# EAGLE schematic OCTOBOARDV_1.1 (EAGLE 9.5.1)
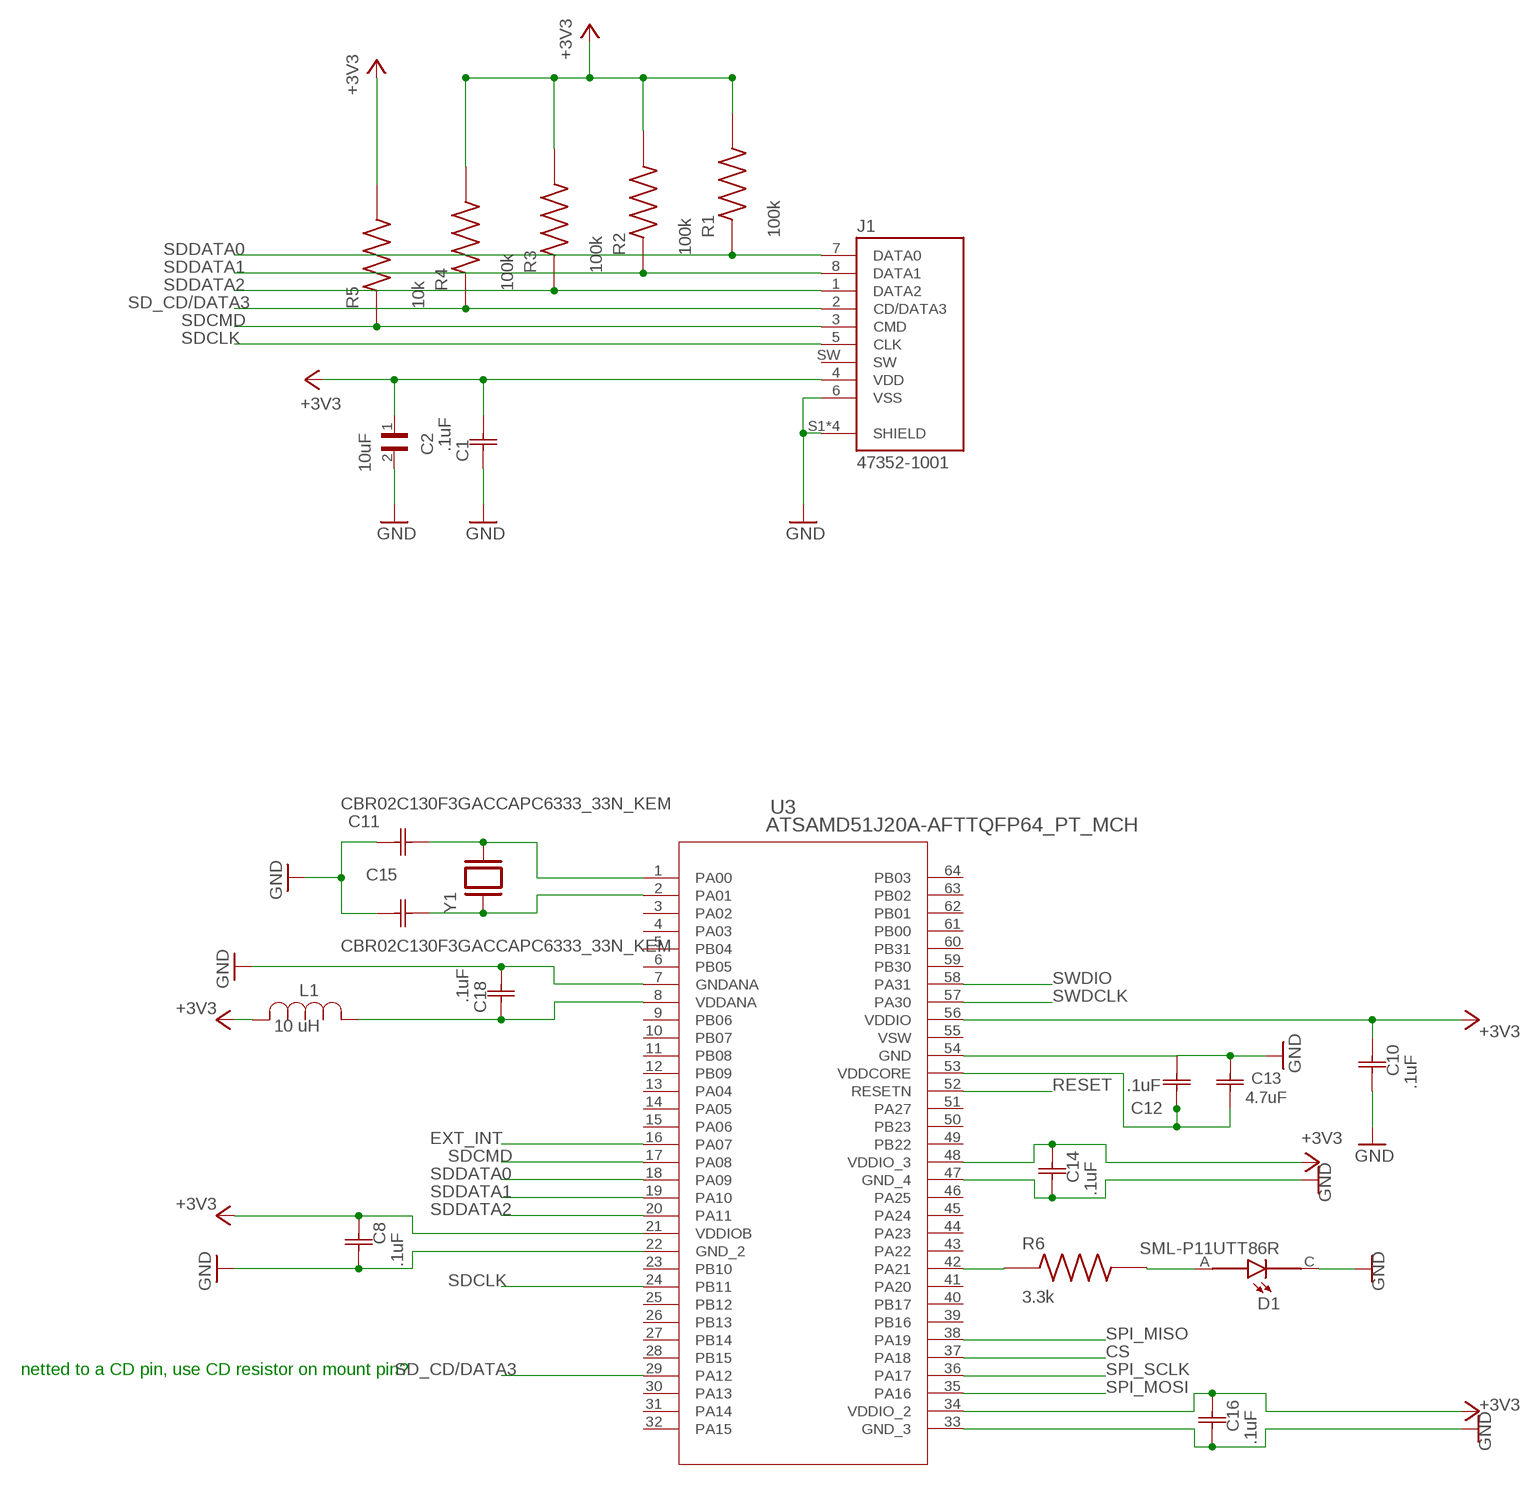
[diagram p0: schematic, sheet 1, part 1 of 2]
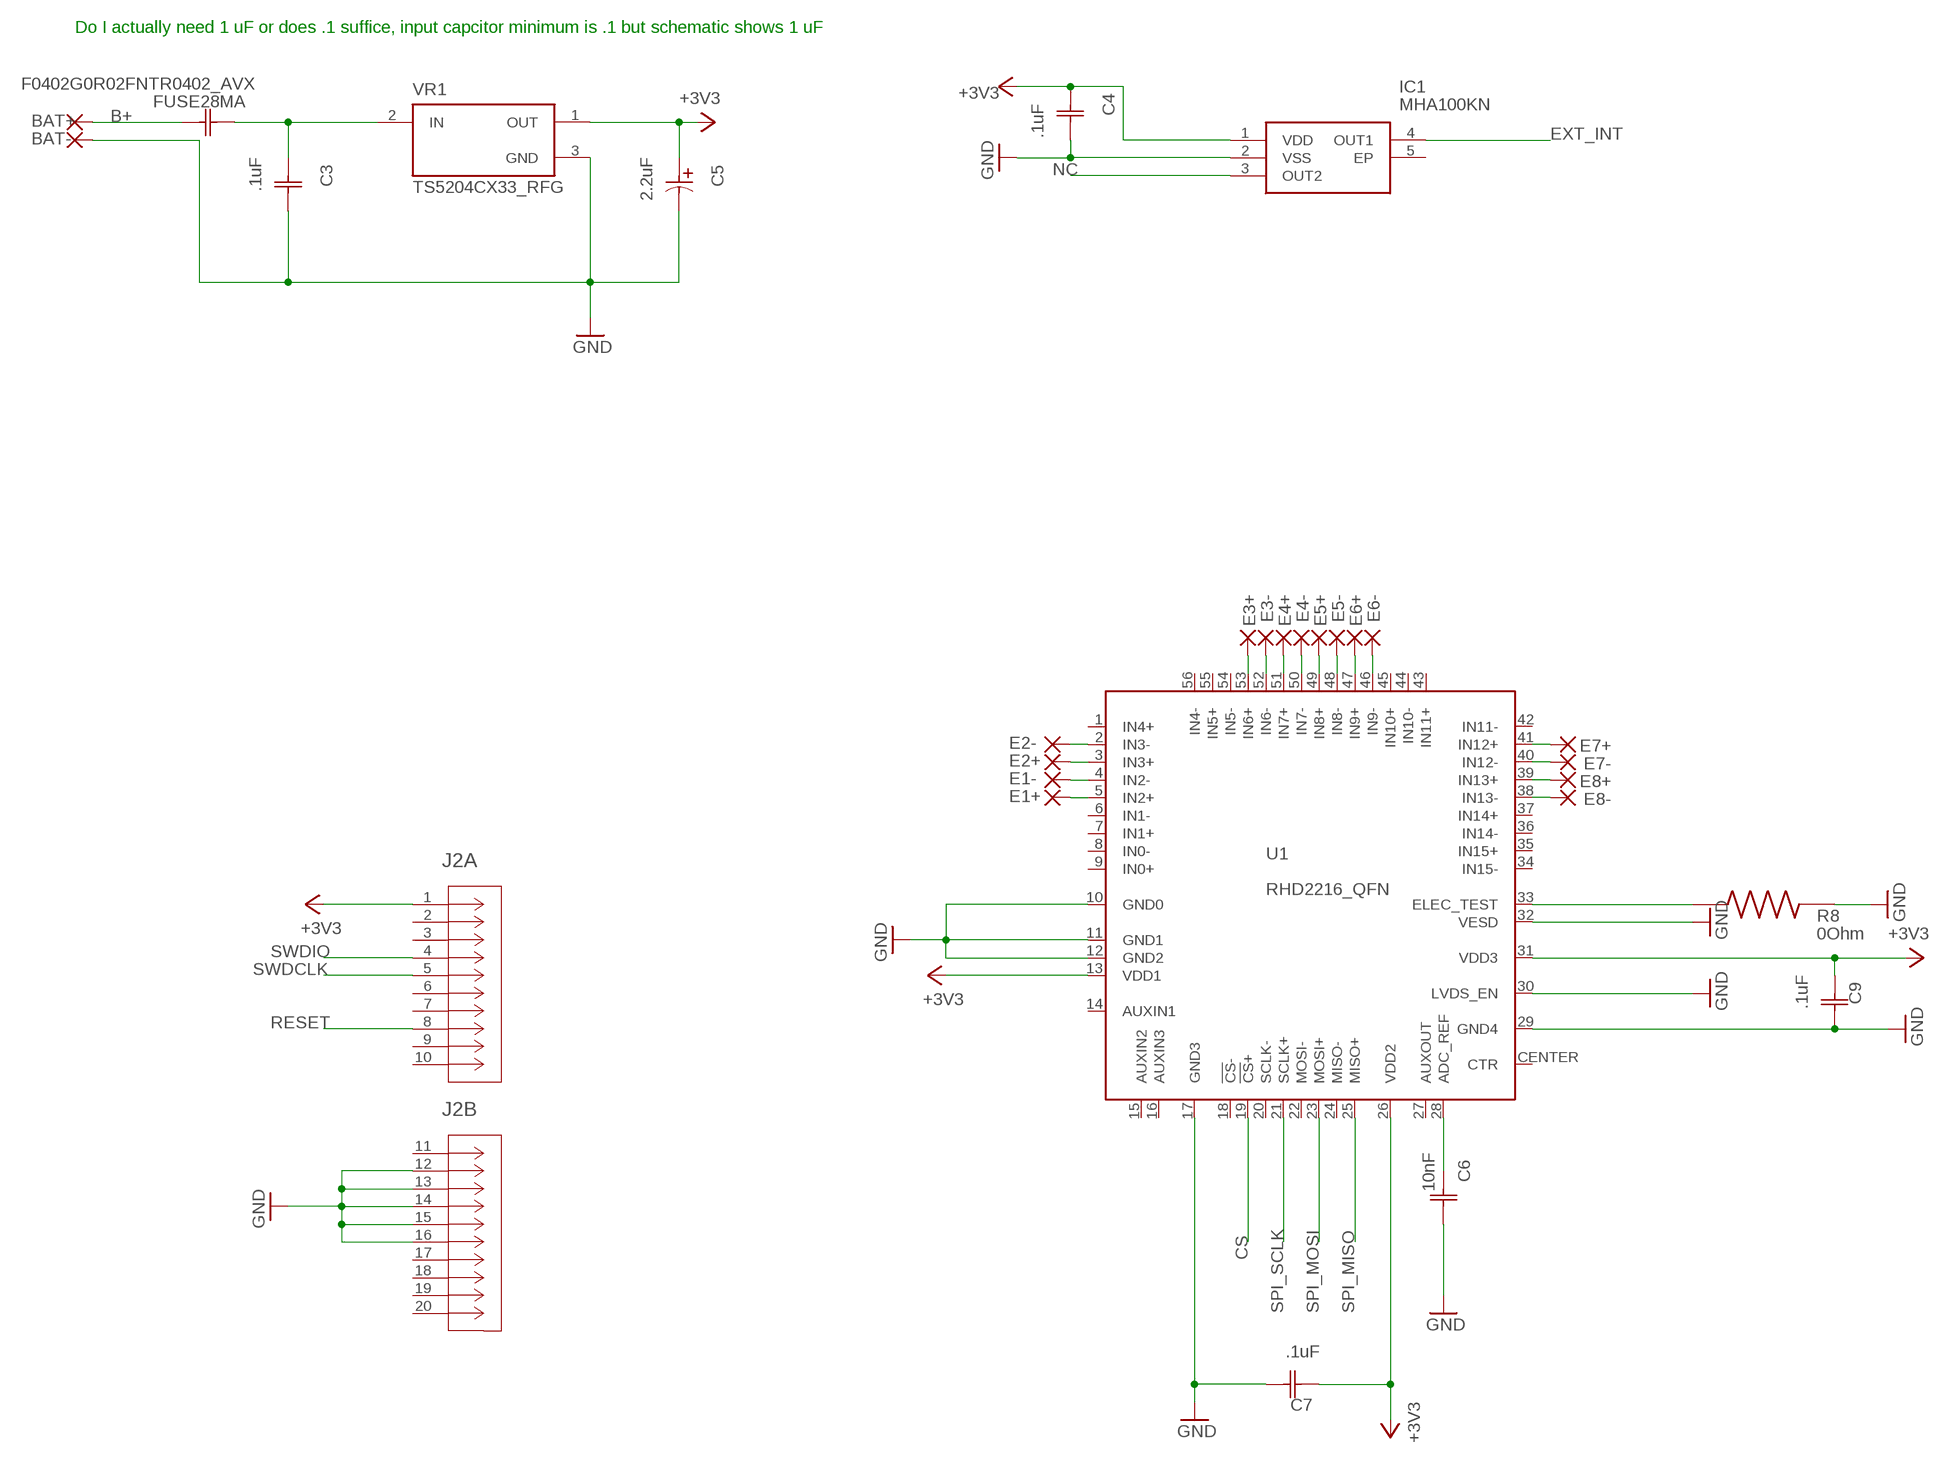
[diagram p1: schematic, sheet 1, part 2 of 2]

## Parts
BAT+  1.36/.71LEAD  [1,6/0,9]
BAT-  1.36/.71LEAD  [1,6/0,9]
C1  .1uF  0402B104K250CTCAP_0402_WAL  [CAP_0402_WAL]
C2  10uF  GRM155R61A106ME11D  [CAPC1005X70N]
C3  .1uF  0402B104K250CTCAP_0402_WAL  [CAP_0402_WAL]
C4  .1uF  0402B104K250CTCAP_0402_WAL  [CAP_0402_WAL]
C5  2.2uF  T491A225K016ATAUTOCAPMP3.4X1.6_1.8N_KEM  [CAPMP3.4X1.6_1.8N_KEM]
C6  10nF  CM02X5R103M16AHCAP_00J25AH_AVX  [CAP_00J25AH_AVX]
C7  .1uF  0402B104K250CTCAP_0402_WAL  [CAP_0402_WAL]
C8  .1uF  0402B104K250CTCAP_0402_WAL  [CAP_0402_WAL]
C9  .1uF  0402B104K250CTCAP_0402_WAL  [CAP_0402_WAL]
C10  .1uF  0402B104K250CTCAP_0402_WAL  [CAP_0402_WAL]
C11  CBR02C130F3GACCAPC6333_33N_KEM  [CAPC6333_33N_KEM]
C12  .1uF  0402B104K250CTCAP_0402_WAL  [CAP_0402_WAL]
C13  4.7uF  CM03X5R475M06AH055CAP_CM03_F_KAV  [CAP_CM03_F_KAV]
C14  .1uF  0402B104K250CTCAP_0402_WAL  [CAP_0402_WAL]
C15  CBR02C130F3GACCAPC6333_33N_KEM  [CAPC6333_33N_KEM]
C16  .1uF  0402B104K250CTCAP_0402_WAL  [CAP_0402_WAL]
C18  .1uF  0402B104K250CTCAP_0402_WAL  [CAP_0402_WAL]
D1  SML-P11UTT86R  [LED_SML-P11UTT86R]
E1+  1.36/.71LEAD  [1,6/0,9]
E1-  1.36/.71LEAD  [1,6/0,9]
E2+  1.36/.71LEAD  [1,6/0,9]
E2-  1.36/.71LEAD  [1,6/0,9]
E3+  1.36/.71LEAD  [1,6/0,9]
E3-  1.36/.71LEAD  [1,6/0,9]
E4+  1.36/.71LEAD  [1,6/0,9]
E4-  1.36/.71LEAD  [1,6/0,9]
E5+  1.36/.71LEAD  [1,6/0,9]
E5-  1.36/.71LEAD  [1,6/0,9]
E6+  1.36/.71LEAD  [1,6/0,9]
E6-  1.36/.71LEAD  [1,6/0,9]
E7+  1.36/.71LEAD  [1,6/0,9]
E7-  1.36/.71LEAD  [1,6/0,9]
E8+  1.36/.71LEAD  [1,6/0,9]
E8-  1.36/.71LEAD  [1,6/0,9]
FUSE28MA  F0402G0R02FNTR0402_AVX  F0402G0R20FNTR0402_AVX  [0402_AVX]
IC1  MHA100KN  [MHA100KN]
J1  47352-1001  [MOLEX_47352-1001]
J2  PRPC040DAAN-RCCONN80_PRP-040_4000X197_SUL  [CONN80_PRP-040_4000X197_SUL]
L1  10 uH  SDEB12101T-100MSDIND_SDEB12101T_CYN  [IND_SDEB12101T_CYN]
R1  100k  ERJ1GNJ104C  [RES_ERJ1GNJ104C]
R2  100k  ERJ1GNJ104C  [RES_ERJ1GNJ104C]
R3  100k  ERJ1GNJ104C  [RES_ERJ1GNJ104C]
R4  100k  ERJ1GNJ104C  [RES_ERJ1GNJ104C]
R5  10k  ERJ-1RHD1002C  [RES_ERJ-1RHD1002C]
R6  3.3k  ERJ-1GNF3301C  [RESC0603X26N]
R8  0Ohm  RMCF0201ZT0R00  [RESC0603X26N]
U1  RHD2216_QFN  [QFN56_8_X_8_LARGE]
U3  ATSAMD51J20A-AFTTQFP64_PT_MCH  [TQFP64_PT_MCH]
VR1  TS5204CX33_RFG  [SOT95P280X110-3N]
Y1  CM9V-T1A-32.768KHZ-9PF-20PPM-TA-QC  [XTAL_CM9V-T1A-32.768KHZ-9PF-20PPM-TA-QC]

## Nets
+3V3: C1.2 C2.1 C4.1 C5.1 C7.1 C8.1 C9.1 C10.1 C14.1 C16.1 IC1.1(VDD) J1.4(VDD) J2.1 L1.2 R1.2 R2.2 R3.2 R4.2 R5.2 U1.13(VDD1) U1.26(VDD2) U1.31(VDD3) U3.21(VDDIOB) U3.34(VDDIO_2) U3.48(VDDIO_3) U3.56(VDDIO) VR1.1(OUT)
B+: BAT+.1(P) FUSE28MA.1
CS: U1.19(!CS!+) U3.37(PA18)
EXT_INT: IC1.4(OUT1) U3.16(PA07)
GND: BAT-.1(P) C1.1 C2.2 C3.2 C4.2 C5.2 C6.2 C7.2 C8.2 C9.2 C10.2 C11.1 C12.2 C13.2 C14.2 C15.1 C16.2 C18.2 D1.C IC1.2(VSS) J1.6(VSS) J1.S1(SHIELD) J1.S2(SHIELD) J1.S3(SHIELD) J1.S4(SHIELD) J2.12 J2.13 J2.14 J2.15 J2.16 R8.2 U1.10(GND0) U1.11(GND1) U1.12(GND2) U1.17(GND3) U1.29(GND4) U1.30(LVDS_EN) U1.32(VESD) U3.7(GNDANA) U3.22(GND_2) U3.33(GND_3) U3.47(GND_4) U3.54(GND) VR1.3(GND)
N$1: C3.1 FUSE28MA.2 VR1.2(IN)
N$2: E2-.1(P) U1.2(IN3-)
N$3: E2+.1(P) U1.3(IN3+)
N$4: E1-.1(P) U1.4(IN2-)
N$5: E1+.1(P) U1.5(IN2+)
N$7: E3-.1(P) U1.52(IN6-)
N$8: E4+.1(P) U1.51(IN7+)
N$9: E4-.1(P) U1.50(IN7-)
N$10: E5+.1(P) U1.49(IN8+)
N$11: E5-.1(P) U1.48(IN8-)
N$12: E6+.1(P) U1.47(IN9+)
N$13: E7+.1(P) U1.41(IN12+)
N$14: E6-.1(P) U1.46(IN9-)
N$15: E7-.1(P) U1.40(IN12-)
N$16: E8+.1(P) U1.39(IN13+)
N$17: E8-.1(P) U1.38(IN13-)
N$18: R6.1 U3.42(PA21)
N$19: C6.1 U1.28(ADC_REF)
N$20: R8.1 U1.33(ELEC_TEST)
N$21 [Test]: C11.2 U3.1(PA00) Y1.2
N$22: C12.1 C13.1 U3.53(VDDCORE)
N$23: C18.1 L1.1 U3.8(VDDANA)
N$24: D1.A R6.2
N$25 [Test]: C15.2 U3.2(PA01) Y1.1
N$26: E3+.1(P) U1.53(IN6+)
NC: IC1.3(OUT2)
RESET: J2.8 U3.52(RESETN)
SD_CD/DATA3: J1.2(CD/DATA3) R4.1 U3.29(PA12)
SDCLK: J1.5(CLK) U3.24(PB11)
SDCMD: J1.3(CMD) R5.1 U3.17(PA08)
SDDATA0: J1.7(DATA0) R1.1 U3.18(PA09)
SDDATA1: J1.8(DATA1) R2.1 U3.19(PA10)
SDDATA2: J1.1(DATA2) R3.1 U3.20(PA11)
SPI_MISO: U1.25(MISO+) U3.38(PA19)
SPI_MOSI: U1.23(MOSI+) U3.35(PA16)
SPI_SCLK: U1.21(SCLK+) U3.36(PA17)
SWDCLK: J2.5 U3.57(PA30)
SWDIO: J2.4 U3.58(PA31)
Unconnected: IC1.5(EP) J1.SW J2.2 J2.3 J2.6 J2.7 J2.9 J2.10 J2.11 J2.17 J2.18 J2.19 J2.20 U1.1(IN4+) U1.6(IN1-) U1.7(IN1+) U1.8(IN0-) U1.9(IN0+) U1.14(AUXIN1) U1.15(AUXIN2) U1.16(AUXIN3) U1.18(!CS!-) U1.20(SCLK-) U1.22(MOSI-) U1.24(MISO-) U1.27(AUXOUT) U1.34(IN15-) U1.35(IN15+) U1.36(IN14-) U1.37(IN14+) U1.42(IN11-) U1.43(IN11+) U1.44(IN10-) U1.45(IN10+) U1.54(IN5-) U1.55(IN5+) U1.56(IN4-) U3.3(PA02) U3.4(PA03) U3.5(PB04) U3.6(PB05) U3.9(PB06) U3.10(PB07) U3.11(PB08) U3.12(PB09) U3.13(PA04) U3.14(PA05) U3.15(PA06) U3.23(PB10) U3.25(PB12) U3.26(PB13) U3.27(PB14) U3.28(PB15) U3.30(PA13) U3.31(PA14) U3.32(PA15) U3.39(PB16) U3.40(PB17) U3.41(PA20) U3.43(PA22) U3.44(PA23) U3.45(PA24) U3.46(PA25) U3.49(PB22) U3.50(PB23) U3.51(PA27) U3.59(PB30) U3.60(PB31) U3.61(PB00) U3.62(PB01) U3.63(PB02) U3.64(PB03)

## Notes on the sheet
- Do I actually need 1 uF or does .1 suffice, input capcitor minimum is .1 but schematic shows 1 uF
- netted to a CD pin, use CD resistor on mount pin?

## Power pins joined to a net without a drawn wire
CTR: U1.CENTER(CTR)
VSW: U3.55(VSW)

## Library data of the parts
BAT+ BAT- E1+ E1- E2+ E2- E3+ E3- E4+ E4- E5+ E5- E6+ E6- E7+ E7- E8+ E8- = wirepadedit:1.36/.71LEAD: THROUGH-HOLE PAD
C1 C3 C4 C7-C10 C12 C14 C16 C18 = 01uFCap:0402B104K250CT; COPYRIGHT: Copyright (C) 2023 Ultra Librarian. All rights reserved.; MANUFACTURER_PART_NUMBER: 0402B104K250CT; MFR_NAME: Walsin
C2 = 10uFCap:GRM155R61A106ME11D: CAP CER 10UF 10V X5R 0402 Check availability <https://pricing.snapeda.com/parts/GRM155R61A106ME11D/Murata%20Electronics/view-part?ref=eda>; AVAILABILITY: In Stock; DESCRIPTION: SMD capacitor X5R(EIA) with capacitance 10uF Tol.20%. Rated voltage 10Vdc 85C; MF: Murata Electronics; MP: GRM155R61A106ME11D; PACKAGE: 1005 Murata; PRICE: None; PURCHASE-URL: https://pricing.snapeda.com/search/part/GRM155R61A106ME11D/?ref=eda
C5 = 2_2uFCap:T491A225K016ATAUTO; COPYRIGHT: Copyright (C) 2023 Ultra Librarian. All rights reserved.; MANUFACTURER_PART_NUMBER: T491A225K016ATAUTO; MFR_NAME: Kemet
C6 = 10nFCap:CM02X5R103M16AH; COPYRIGHT: Copyright (C) 2023 Ultra Librarian. All rights reserved.; MANUFACTURER_PART_NUMBER: CM02X5R103M16AH; MFR_NAME: KYOCERA AVX
C11 C15 = 13pFCap:CBR02C130F3GAC; COPYRIGHT: Copyright (C) 2023 Ultra Librarian. All rights reserved.; MANUFACTURER_PART_NUMBER: CBR02C130F3GAC; MFR_NAME: Kemet
C13 = 4_7uFCap0603:CM03X5R475M06AH055; COPYRIGHT: Copyright (C) 2023 Ultra Librarian. All rights reserved.; MANUFACTURER_PART_NUMBER: CM03X5R475M06AH055; MFR_NAME: KYOCERA AVX
D1 = SML_P11UTT86R:SML-P11UTT86R: LED, PICOLED, Red, 621 nm, 1.8 V, 1 mA, 2.5 mcd; MANUFACTURER: ROHM Semiconductor; PARTREV: 007; STANDARD: Manufacturer Recommendation
FUSE28MA = fuse28mA:F0402G0R20FNTR; COPYRIGHT: Copyright (C) 2023 Ultra Librarian. All rights reserved.; MANUFACTURER_PART_NUMBER: F0402G0R20FNTR; MFR_NAME: KYOCERA AVX
IC1 = MHA100KN:MHA100KN: Board Mount Hall Effect / Magnetic Sensors High Performance Low Power Hall-Effect Sensor Source: Datasheet <https://www.memsic.com/Public/Uploads/uploadfile/files/20220119/MHA100KNDatasheetRevA.pdf>; DESCRIPTION: Board Mount Hall Effect / Magnetic Sensors High Performance Low Power Hall-Effect Sensor; HEIGHT: 0.42mm; MANUFACTURER_NAME: MEMSIC; MANUFACTURER_PART_NUMBER: MHA100KN; MOUSER_PART_NUMBER: 438-MHA100KN; MOUSER_PRICE-STOCK: https://www.mouser.co.uk/ProductDetail/MEMSIC/MHA100KN?qs=W%2FMpXkg%252BdQ6cWUMxnX3l5w%3D%3D
J1 = 47352-1001:47352-1001: 1.10mm Pitch microSD Card Connector, Push-Push Type, with VSS (Supply Voltage Ground) Detect Switch, Lead-Free; DESCRIPTION: 8 (6 + 2) Position Card Connector Secure Digital - microSD™ Surface Mount, Right Angle Gold; DIGI-KEY_PART_NUMBER: WM3290CT-ND; MF: Molex; MP: 47352-1001; PACKAGE: None; PURCHASE-URL: https://pricing.snapeda.com/search/part/47352-1001/?ref=eda
J2 = Header:PRPC040DAAN-RC; COPYRIGHT: Copyright (C) 2023 Ultra Librarian. All rights reserved.; MANUFACTURER_PART_NUMBER: PRPC040DAAN-RC; MFR_NAME: Sullins; TYPE: Headers, Male Pins
L1 = 10uH_inductor:SDEB12101T-100MSD; COPYRIGHT: Copyright (C) 2023 Ultra Librarian. All rights reserved.; MANUFACTURER_PART_NUMBER: SDEB12101T-100MSD; MFR_NAME: Cyntec
R1-R4 = 100kRes:ERJ1GNJ104C: Check availability <https://pricing.snapeda.com/parts/ERJ-1GNJ104C/Panasonic/view-part?ref=eda>; AVAILABILITY: In Stock; DESCRIPTION: 100 kOhms 5% 0.05W, 1/20W Chip Resistor 0201 (0603 Metric) Automotive AEC-Q200 Thick Film; MF: Panasonic; MP: ERJ-1GNJ104C; PACKAGE: 0603-2 Panasonic; PRICE: None; PURCHASE-URL: https://pricing.snapeda.com/search/part/ERJ-1GNJ104C/?ref=eda
R5 = 10kRes:ERJ-1RHD1002C: Check availability <https://pricing.snapeda.com/parts/ERJ-1RHD1002C/Panasonic%20Electronic/view-part?ref=eda>; AVAILABILITY: In Stock; DESCRIPTION: 10 kOhms ±0.5% 0.05W, 1/20W Chip Resistor 0201 (0603 Metric) - Thick Film; MF: Panasonic Electronic; MP: ERJ-1RHD1002C; PACKAGE: 201-2 Panasonic; PRICE: None; PURCHASE-URL: https://pricing.snapeda.com/search/part/ERJ-1RHD1002C/?ref=eda
R6 = 3_3kRes:ERJ-1GNF3301C: Res Thick Film 0201 3.3K Ohm 1% 0.05W(1/20W) ±200ppm/C SMD Automotive T/R
R8 = RMCF0201ZT0R00:RMCF0201ZT0R00: Check availability <https://pricing.snapeda.com/parts/RMCF0201ZT0R00/Stackpole%20Electronics%20Inc/view-part?ref=eda>; AVAILABILITY: In Stock; DESCRIPTION: 0 Ohms Jumper 0.05W, 1/20W Chip Resistor 0201 (0603 Metric) - Thick Film; MF: Stackpole Electronics Inc; MP: RMCF0201ZT0R00; PACKAGE: 0603 Rohm Semiconductor; PRICE: None; PURCHASE-URL: https://pricing.snapeda.com/search/part/RMCF0201ZT0R00/?ref=eda
U1 = RHD2000:RHD2216: Intan Technologies RHD2216 chip
U3 = ATSAMD51j20AAFT:ATSAMD51J20A-AFT; COPYRIGHT: Copyright (C) 2023 Ultra Librarian. All rights reserved.; MANUFACTURER_PART_NUMBER: ATSAMD51J20A-AFT; MFR_NAME: Microchip
VR1 = TS5204CX33_RFG_VLTREG:TS5204CX33_RFG: Check availability <https://pricing.snapeda.com/parts/TS5204CX33%20RFG/Taiwan%20Semiconductor%20Corporation/view-part?ref=eda>; AVAILABILITY: In Stock; DESCRIPTION: 80MA 3.3V ULTRA LOW DROPOUT VOLTAGE REGULATOR; MF: Taiwan Semiconductor Corporation; MP: TS5204CX33 RFG; PACKAGE: SOT-23-3 Taiwan Semiconductor; PRICE: None; PURCHASE-URL: https://pricing.snapeda.com/search/part/TS5204CX33 RFG/?ref=eda
Y1 = CM9V-T1A-32.768KHZ-9PF-20PPM-TA-QC:CM9V-T1A-32.768KHZ-9PF-20PPM-TA-QC: Check availability <https://pricing.snapeda.com/parts/CM9V-T1A-32.768KHZ-9PF-20PPM-TA-QC/Micro%20Crystal%20AG/view-part?ref=eda>; AVAILABILITY: In Stock; DESCRIPTION: LOW FREQUENCY CRYSTAL; MF: Micro Crystal AG; MP: CM9V-T1A-32.768KHZ-9PF-20PPM-TA-QC; PACKAGE: SMD-2 Micro Crystal; PRICE: None; PURCHASE-URL: https://pricing.snapeda.com/search/part/CM9V-T1A-32.768KHZ-9PF-20PPM-TA-QC/?ref=eda